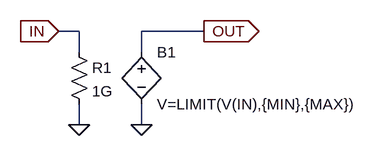
[diagram p0: schematic Limitg.asc]
Limitg.asc, the LTspice schematic file:
Version 4
SHEET 1 880 680
WIRE 112 112 80 112
WIRE 304 112 208 112
WIRE 112 144 112 112
WIRE 208 144 208 112
WIRE 112 256 112 224
WIRE 208 256 208 224
FLAG 208 256 0
FLAG 304 112 OUT
IOPIN 304 112 Out
FLAG 80 112 IN
IOPIN 80 112 In
FLAG 112 256 0
SYMBOL bv 208 128 R0
SYMATTR InstName B1
SYMATTR Value V=LIMIT(V(IN),{MIN},{MAX})
SYMBOL res 96 128 R0
SYMATTR InstName R1
SYMATTR Value 1G

The netlist it stands for:
* Limitg.asc
B1 OUT 0 V=LIMIT(V(IN),{MIN},{MAX})
R1 IN 0 1G
.backanno
.end